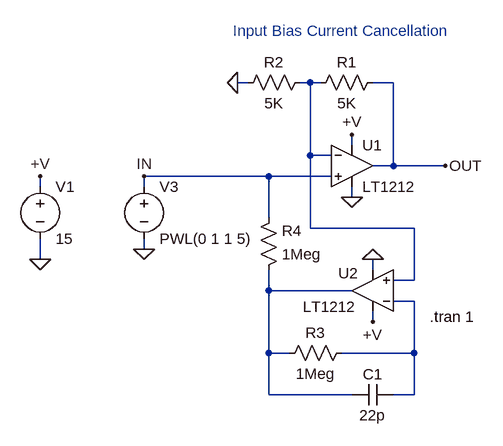
[diagram p0: schematic 1212.asc]
1212.asc, the LTspice schematic file:
Version 4
SHEET 1 896 704
WIRE 32 112 16 112
WIRE 128 112 112 112
WIRE 144 112 128 112
WIRE 256 112 224 112
WIRE 192 208 192 192
WIRE 128 224 128 112
WIRE 160 224 128 224
WIRE 256 240 256 112
WIRE 256 240 224 240
WIRE 336 240 256 240
WIRE 64 256 -128 256
WIRE 160 256 64 256
WIRE -288 272 -288 256
WIRE -128 272 -128 256
WIRE 192 288 192 272
WIRE 64 320 64 256
WIRE 128 336 128 224
WIRE 288 336 128 336
WIRE -128 368 -128 352
WIRE -288 384 -288 352
WIRE 224 400 224 384
WIRE 288 416 288 336
WIRE 288 416 256 416
WIRE 64 432 64 400
WIRE 192 432 64 432
WIRE 288 448 256 448
WIRE 224 480 224 464
WIRE 64 528 64 432
WIRE 96 528 64 528
WIRE 288 528 288 448
WIRE 288 528 176 528
WIRE 64 592 64 528
WIRE 192 592 64 592
WIRE 288 592 288 528
WIRE 288 592 256 592
FLAG -288 384 0
FLAG 192 192 +V
FLAG -288 256 +V
FLAG 16 112 0
FLAG -128 368 0
FLAG 224 480 +V
FLAG 192 288 0
FLAG 224 384 0
FLAG 336 240 OUT
FLAG -128 256 IN
SYMBOL voltage -288 256 R0
SYMATTR InstName V1
SYMATTR Value 15
SYMBOL res 240 96 R90
WINDOW 0 0 56 VBottom 2
WINDOW 3 32 56 VTop 2
SYMATTR InstName R1
SYMATTR Value 5K
SYMBOL res 128 96 R90
WINDOW 0 0 56 VBottom 2
WINDOW 3 32 56 VTop 2
SYMATTR InstName R2
SYMATTR Value 5K
SYMBOL voltage -128 256 R0
WINDOW 123 0 0 Left 2
WINDOW 39 0 0 Left 2
SYMATTR InstName V3
SYMATTR Value PWL(0 1 1 5)
SYMBOL res 192 512 R90
WINDOW 0 0 56 VBottom 2
WINDOW 3 32 56 VTop 2
SYMATTR InstName R3
SYMATTR Value 1Meg
SYMBOL cap 256 576 R90
WINDOW 0 0 32 VBottom 2
WINDOW 3 32 32 VTop 2
SYMATTR InstName C1
SYMATTR Value 22p
SYMBOL res 48 416 M180
WINDOW 0 36 76 Left 2
WINDOW 3 36 40 Left 2
SYMATTR InstName R4
SYMATTR Value 1Meg
SYMBOL opamps\\LT1212 192 176 R0
SYMATTR InstName U1
SYMBOL opamps\\LT1212 224 496 R180
WINDOW 0 22 91 Left 2
WINDOW 3 25 39 Left 2
SYMATTR InstName U2
TEXT 312 472 Left 2 !.tran 1
TEXT 176 48 Bottom 2 ;Input Bias Current Cancellation

The netlist it stands for:
* 1212.asc
V1 +V 0 15
R1 OUT N001 5K
R2 N001 0 5K
V3 IN 0 PWL(0 1 1 5)
R3 N003 N002 1Meg
C1 N003 N002 22p
R4 N002 IN 1Meg
XU1 IN N001 +V 0 OUT LT1212  ; pins In+ In- V+ V- OUT
XU2 N001 N003 +V 0 N002 LT1212  ; pins In+ In- V+ V- OUT
.tran 1
* Input Bias Current Cancellation
.backanno
.end